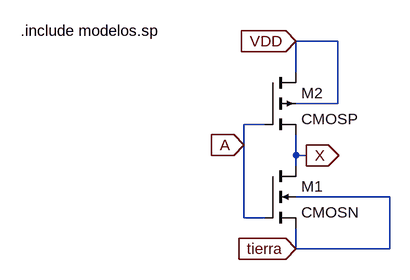
[diagram p0: schematic Inversor2mA.asc]
Inversor2mA.asc, the LTspice schematic file:
Version 4
SHEET 1 1388 680
WIRE 368 16 304 16
WIRE 304 64 304 16
WIRE 368 112 368 16
WIRE 368 112 304 112
WIRE 256 144 224 144
WIRE 224 176 224 144
WIRE 304 192 304 160
WIRE 320 192 304 192
WIRE 304 208 304 192
WIRE 448 256 304 256
WIRE 224 288 224 176
WIRE 256 288 224 288
WIRE 304 336 304 304
WIRE 448 336 448 256
WIRE 448 336 304 336
FLAG 224 176 A
IOPIN 224 176 In
FLAG 304 16 VDD
IOPIN 304 16 In
FLAG 304 336 tierra
IOPIN 304 336 In
FLAG 320 192 X
IOPIN 320 192 Out
SYMBOL nmos4 256 208 R0
SYMATTR InstName M1
SYMATTR Value CMOSN
SYMATTR Value2 l=0.6u w=7.5u
SYMBOL pmos4 256 64 R0
SYMATTR InstName M2
SYMATTR Value CMOSP
SYMATTR Value2 l=.6u w=26.7u
TEXT -120 0 Left 2 !.include modelos.sp

The netlist it stands for:
* Inversor2mA.asc
M1 X A tierra tierra CMOSN l=0.6u w=7.5u
M2 VDD A X VDD CMOSP l=.6u w=26.7u
.model NMOS NMOS
.model PMOS PMOS
.lib standard.mos
.include modelos.sp
.backanno
.end